# EAGLE schematic team_flag (EAGLE 7.6.0)
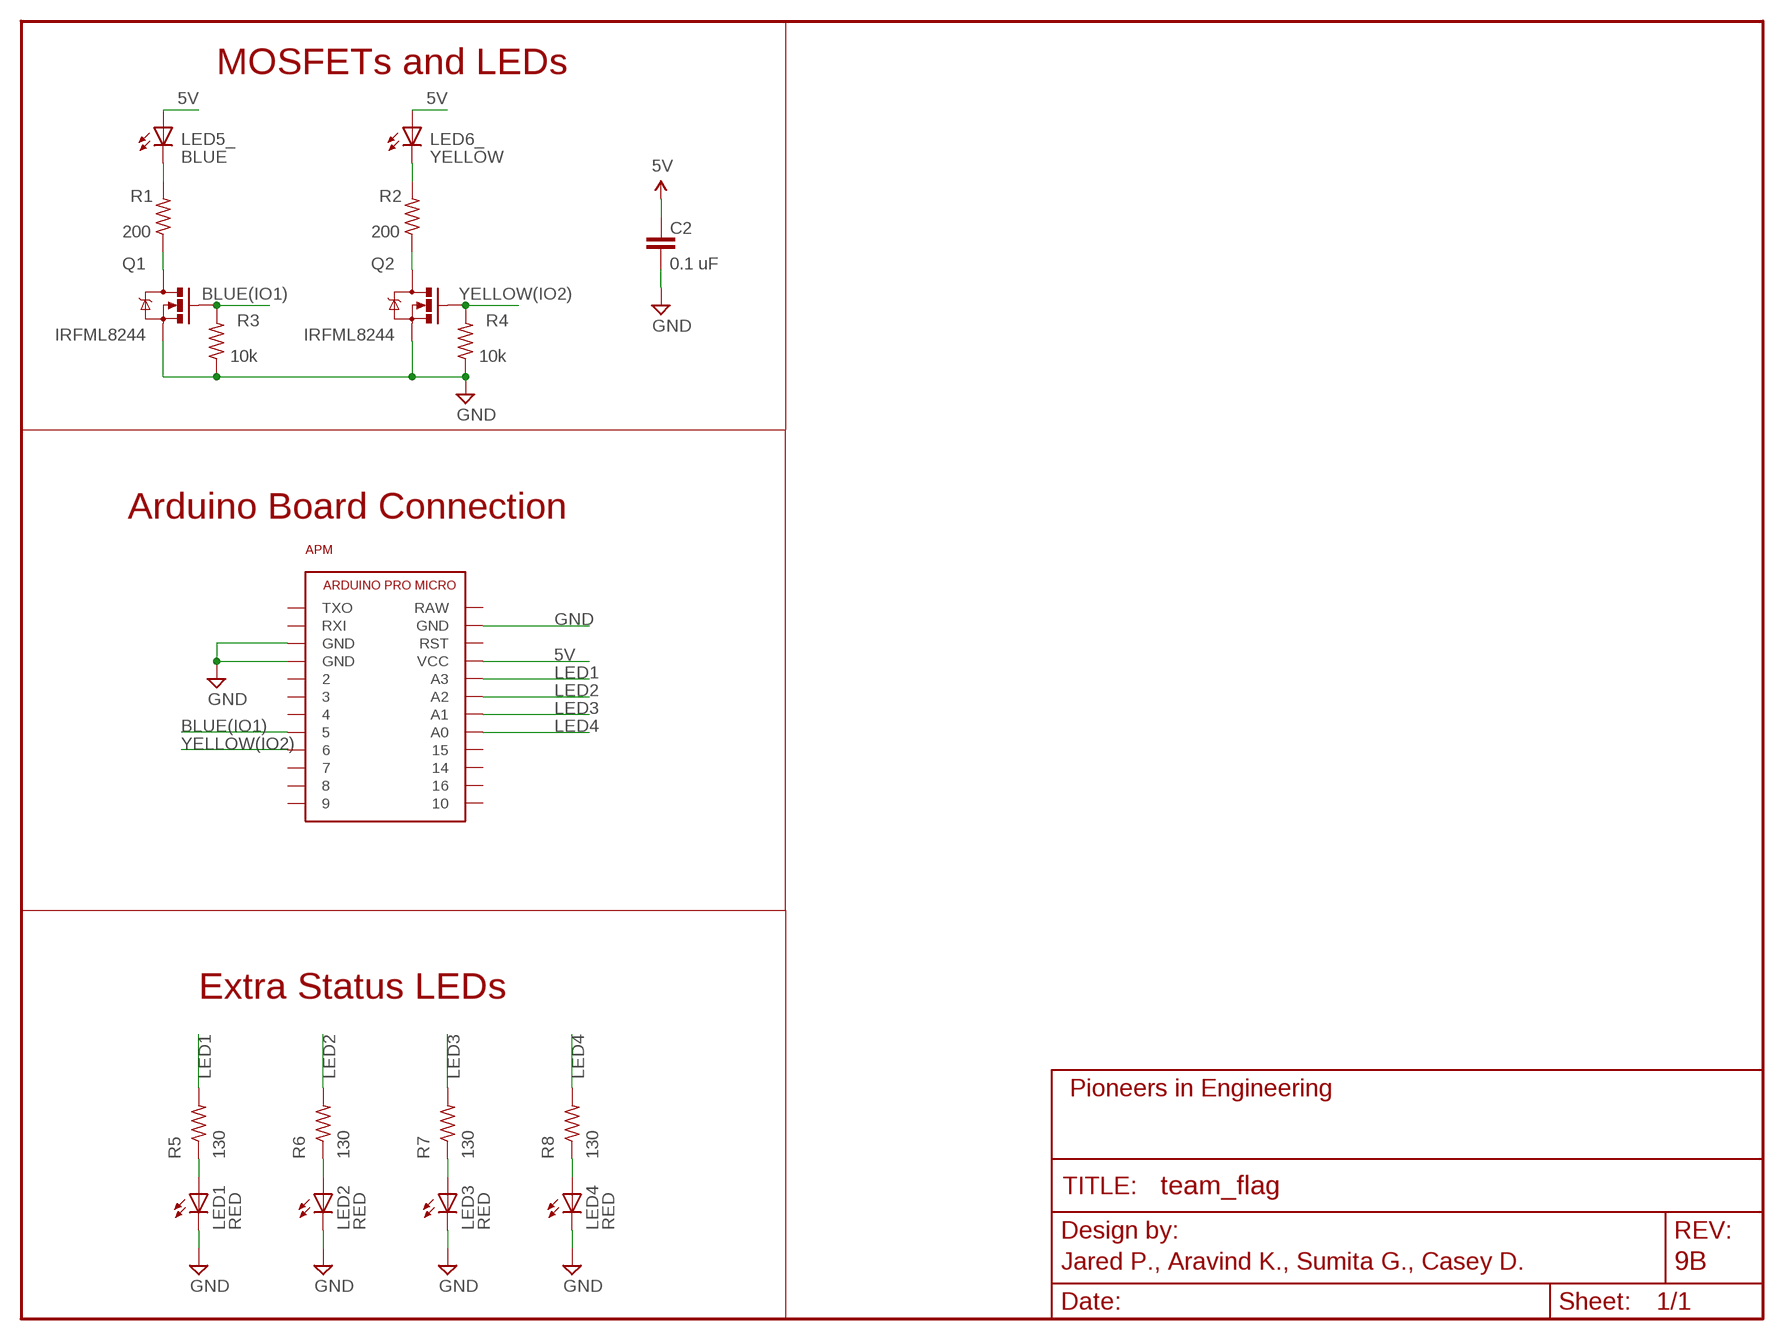
[diagram p0: schematic, sheet 1]
FRAME1 (FRAME_SCHEMATIC): AUTHOR: Jared P., Aravind K., Sumita G., Casey D.; REVISION: 9B

## Parts
APM  ARDUINO_PRO_MICRO  [ARDUINO_PRO_MICRO]
C2  0.1 uF  CAP0603-CAP  [0603-CAP]
LED1  RED  LED0805  [LED-0805]
LED2  RED  LED0805  [LED-0805]
LED3  RED  LED0805  [LED-0805]
LED4  RED  LED0805  [LED-0805]
LED5_  BLUE  LEDLED5MM-NOFLAT  [LED5MM-NOFLAT]
LED6_  YELLOW  LEDLED5MM-NOFLAT  [LED5MM-NOFLAT]
Q1  IRFML8244  MOSFET-NCHANNELSMD  [SOT23-3]
Q2  IRFML8244  MOSFET-NCHANNELSMD  [SOT23-3]
R1  200  R-US_R0603  [R0603]
R2  200  R-US_R0603  [R0603]
R3  10k  R-US_R0603  [R0603]
R4  10k  R-US_R0603  [R0603]
R5  130  R-US_R0603  [R0603]
R6  130  R-US_R0603  [R0603]
R7  130  R-US_R0603  [R0603]
R8  130  R-US_R0603  [R0603]

## Nets
5V: APM.VCC C2.1 LED5_.A LED6_.A
BLUE(IO1): APM.5 Q1.1(G) R3.2
BSOURCE: Q1.3(D) R1.1
GND: APM.GND@0(GND) APM.GND@1(GND) APM.GND@2(GND) C2.2 LED1.C LED2.C LED3.C LED4.C Q1.2(S) Q2.2(S) R3.1 R4.1
LED1: APM.A3 R5.2
LED1R: LED1.A R5.1
LED2: APM.A2 R6.2
LED2R: LED2.A R6.1
LED3: APM.A1 R7.2
LED3R: LED3.A R7.1
LED4: APM.A0 R8.2
LED4R: LED4.A R8.1
N$2: LED5_.K(C) R1.2
N$3: LED6_.K(C) R2.2
YELLOW(IO2): APM.6 Q2.1(G) R4.2
YSOURCE: Q2.3(D) R2.1
Unconnected: APM.2 APM.3 APM.4 APM.7 APM.8 APM.9 APM.10 APM.14 APM.15 APM.16 APM.RAW APM.RST APM.RXI APM.TXO

## Notes on the sheet
- MOSFETs and LEDs
- Arduino Board Connection
- Extra Status LEDs

## Library data of the parts
APM = pie:ARDUINO_PRO_MICRO: Arduino Pro Micro Electrical System Year 9's Smart Sensor Core Pin Outs <https://cdn.sparkfun.com/assets/9/c/3/c/4/523a1765757b7f5c6e8b4567.png> Buy Here <http://www.aliexpress.com/item/Mini-Leonardo-Pro-Micro-ATmega32U4-5V-16MHz-Module-For-Arduino-Best-Quality/32284746884.html?ws_ab_test=searchweb201556_8,searchweb201602_2_10057_10056_10065_10055_10054_10067_10069_10059_10058_10017_10070_10060_10061_10052_10062_10053_10050_10051,searchweb201603_1&btsid=45993952-29ca-4de4-a0fb-c7fb72b8e1a5>
C2 = pie:CAP: Capacitor Standard 0603 ceramic capacitor, and 0.1" leaded capacitor.; PIE-INT-REF-NUM: CAPACITOR-GENERIC
LED1-LED4 LED5_ LED6_ = pie:LED: LEDs Standard schematic elements and footprints for 5mm, 3mm, 1206, and 0603 sized LEDs. 5mm - Spark Fun Electronics SKU : COM-00529 (and others); PIE-INT-REF-NUM: LED
Q1 Q2 = pie:MOSFET-NCHANNEL: N-Type MOSFET, SOT23-3 Package; PIE-INT-REF-NUM: NMOS
R1-R8 = pie:R-US_: RESISTOR, American symbol; PIE-INT-REF-NUM: RESISTOR-GENERIC